# Altium project Simple RC.PrjPCB
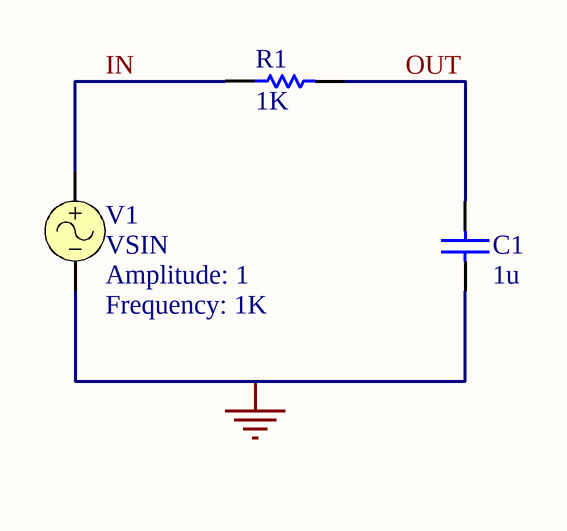
[diagram p0: Simple RC.SchDoc]
1 sheet, 3 parts. Net scope: global (net labels, ports and power ports of the same name join across sheets).

## Sheet Simple RC.SchDoc
size A4; Organization: Altium Limited; Address1: L3, 12a Rodborough Rd; Address2: Frenchs Forest; Address3: NSW; Address4: Australia 2086; DocumentNumber: 1; SheetNumber: 1; SheetTotal: 1

### Parts
C1  value 1u  [RAD-0.3]  (hidden comment: Cap)
R1  value 1K  [AXIAL-0.3]  (hidden comment: Res1)
V1  VSIN  Amplitude: 1  Frequency: 1K

### Nets
GND: C1.1 V1.2
IN: R1.1 V1.1
OUT: C1.2 R1.2

### Notes on the sheet
- Title
- Size:
- Date:
- A4
- Number:
- Time:
- Revision:
- Sheet
- of
- File:

### Library data of the parts
C1 = Cap: Capacitor; Manufacturer: Generic Components; Class I: Passive; Published: 8-Jun-2000; Revision: July-2002: Re-released for DXP Platform.; Publisher: Altium Limited; Class II: Capacitor
R1 = Res1: Resistor; Manufacturer: Generic Components; Class I: Passive; Published: 8-Jun-2000; Revision: July-2002: Re-released for DXP Platform.; Publisher: Altium Limited; Class II: Resistor
V1 = VSIN: Sinusoidal Voltage Source; Manufacturer: Generic Components; Revision 1: 15-Jun-2001: Default value added for damping factor (F8:0).; Revision 2: 17-July-2002: Re-released for DXP Platform.; Class I: Simulation; Note: PCB Footprint - Not required; Published: 8-Jun-2000; Package Reference: Not Applicable; Publisher: Altium Limited; Class II: Voltage Source